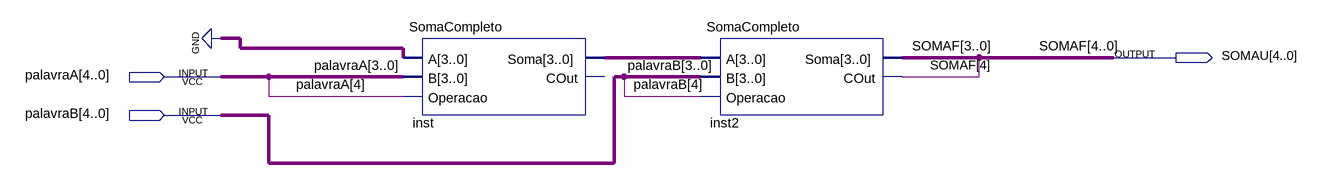
[diagram p0: schematic sheet]
// Quartus schematic AsomaB.bdf as structural Verilog: 2 symbols, 3 pins
module AsomaB (
  input  [4:0] palavraA,
  input  [4:0] palavraB,
  output [4:0] SOMAU
);

  wire [3:0] inst_soma;

  SomaCompleto inst (.A(4'b0000), .B(palavraA[3:0]), .Operacao(palavraA[4]), .Soma(inst_soma));  // open: COut
  SomaCompleto inst2 (.A(inst_soma), .B(palavraB[3:0]), .Operacao(palavraB[4]), .Soma(SOMAU[3:0]), .COut(SOMAU[4]));

  // Other names for the same wires on the sheet: SOMAF[4:0] = SOMAU
endmodule
